# Altium schematic sheet LEDs.SchDoc
size A
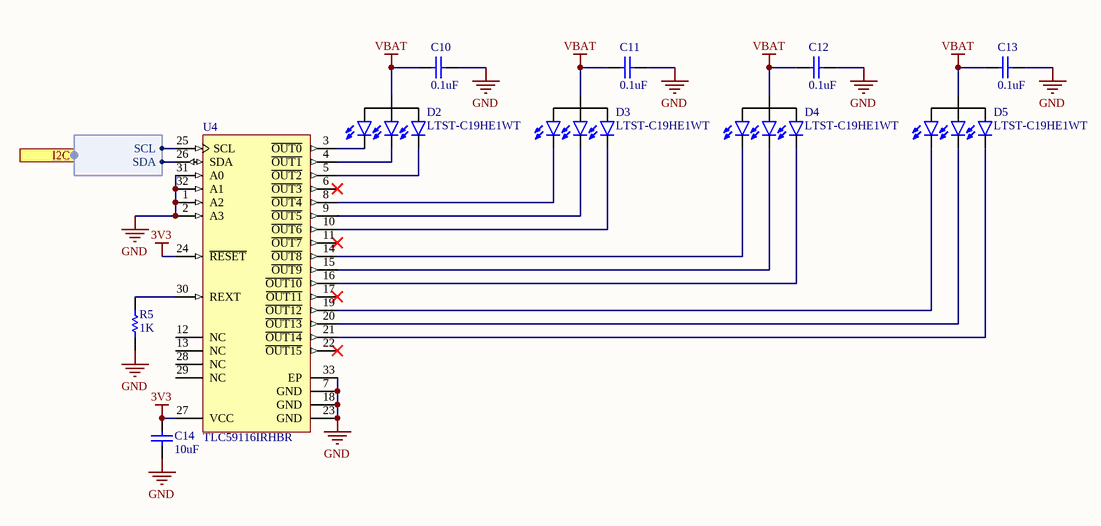
[diagram p0: LEDs.SchDoc]

## Parts
C10  value 0.1uF  [C0402[1005X55]]  (hidden comment: 0.1uF 6.3V 0402)
C11  value 0.1uF  [C0402[1005X55]]  (hidden comment: 0.1uF 6.3V 0402)
C12  value 0.1uF  [C0402[1005X55]]  (hidden comment: 0.1uF 6.3V 0402)
C13  value 0.1uF  [C0402[1005X55]]  (hidden comment: 0.1uF 6.3V 0402)
C14  value 10uF  [C0402[1005X55]]  (hidden comment: 10uF 6.3V 0402)
D2  LTST-C19HE1WT  [LED0606]
D3  LTST-C19HE1WT  [LED0606]
D4  LTST-C19HE1WT  [LED0606]
D5  LTST-C19HE1WT  [LED0606]
R5  value 1K  [R0402[1005]]  (hidden comment: 1K 1% 0402)
U4  TLC59116IRHBR  [VQFN-32]

## Ports
I2C (harness I2C)

## Harnesses
I2C: SCL, SDA

## Nets
3V3: C14.2 U4.24(~{RESET}) U4.27(VCC)
GND: C10.2 C11.2 C12.2 C13.2 C14.1 R5.1 U4.1(A2) U4.2(A3) U4.7(GND) U4.18(GND) U4.23(GND) U4.31(A0) U4.32(A1) U4.33(EP)
VBAT: C10.1 C11.1 C12.1 C13.1 D2.4(A) D3.4(A) D4.4(A) D5.4(A)
NetD2_1: D2.1(K_Red) U4.3(~{OUT0})
NetD2_2: D2.2(K_Green) U4.4(~{OUT1})
NetD2_3: D2.3(K_Blue) U4.5(~{OUT2})
NetD3_1: D3.1(K_Red) U4.8(~{OUT4})
NetD3_2: D3.2(K_Green) U4.9(~{OUT5})
NetD3_3: D3.3(K_Blue) U4.10(~{OUT6})
NetD4_1: D4.1(K_Red) U4.14(~{OUT8})
NetD4_2: D4.2(K_Green) U4.15(~{OUT9})
NetD4_3: D4.3(K_Blue) U4.16(~{OUT10})
NetD5_1: D5.1(K_Red) U4.19(~{OUT12})
NetD5_2: D5.2(K_Green) U4.20(~{OUT13})
NetD5_3: D5.3(K_Blue) U4.21(~{OUT14})
NetR5_2: R5.2 U4.30(REXT)
NetU4_25: U4.25(SCL) ; port I2C.SCL
NetU4_26: U4.26(SDA) ; port I2C.SDA

Not connected (* = marked no-connect by the designer): U4 6(~{OUT3})* 11(~{OUT7})* 12(NC) 13(NC) 17(~{OUT11})* 22(~{OUT15})* 28(NC) 29(NC)

## Library data of the parts
C10-C13 = CAP_0.1uF_6.3V_0402_10%: 0.1uF 6.3V 10% 0402 (1005 Metric); PartNumber: GRM155R70J104KA01D; Manufacturer: Murata; Mounting Technology: Surface Mount; PackageReference: 0402; PackageDescription: 0402 (1005 Metric); Voltage: 6.3V; Tolerance: 10%
C14 = CAP_10uF_6.3V_0402_20%: 10uF 6.3V 20% 0402 (1005 Metric); PartNumber: GRM155R60J106ME44D; Manufacturer: Murata; Mounting Technology: Surface Mount; PackageReference: 0402; PackageDescription: 0402 (1005 Metric); Voltage: 6.3V; Tolerance: 20%
D2-D5 = LTST-C19HE1WT: Manufacturer: Lite-On Inc.; PartNumber: LTST-C19HE1WT; PackageReference: 0606; Mounting Technology: Surface Mount; PackageDescription: 0606 (1616 Metric)
R5 = RES_1K_0402_1%: 1K 0.063W 1% 0402 (1005 Metric); Manufacturer: KOA Speer; PartNumber: RK73H1ETTP1001F; Tolerance: 1%; Power: 0.063W; Mounting Technology: Surface Mount; PackageReference: 0402; PackageDescription: 0402 (1005 Metric); ComponentLink1Description: Datasheet; ComponentLink1URL: http://www.koaspeer.com/catimages/Products/RK73H/RK73H.pdf
U4 = TLC59116IRHBR: IC LED DRVR LIN DIM 120MA 32VQFN; Manufacturer: Texas Instruments; PartNumber: TLC59116IRHBR; PackageReference: QFN-32; Mounting Technology: Surface Mount